# EAGLE schematic untitled (EAGLE 8.4.3)
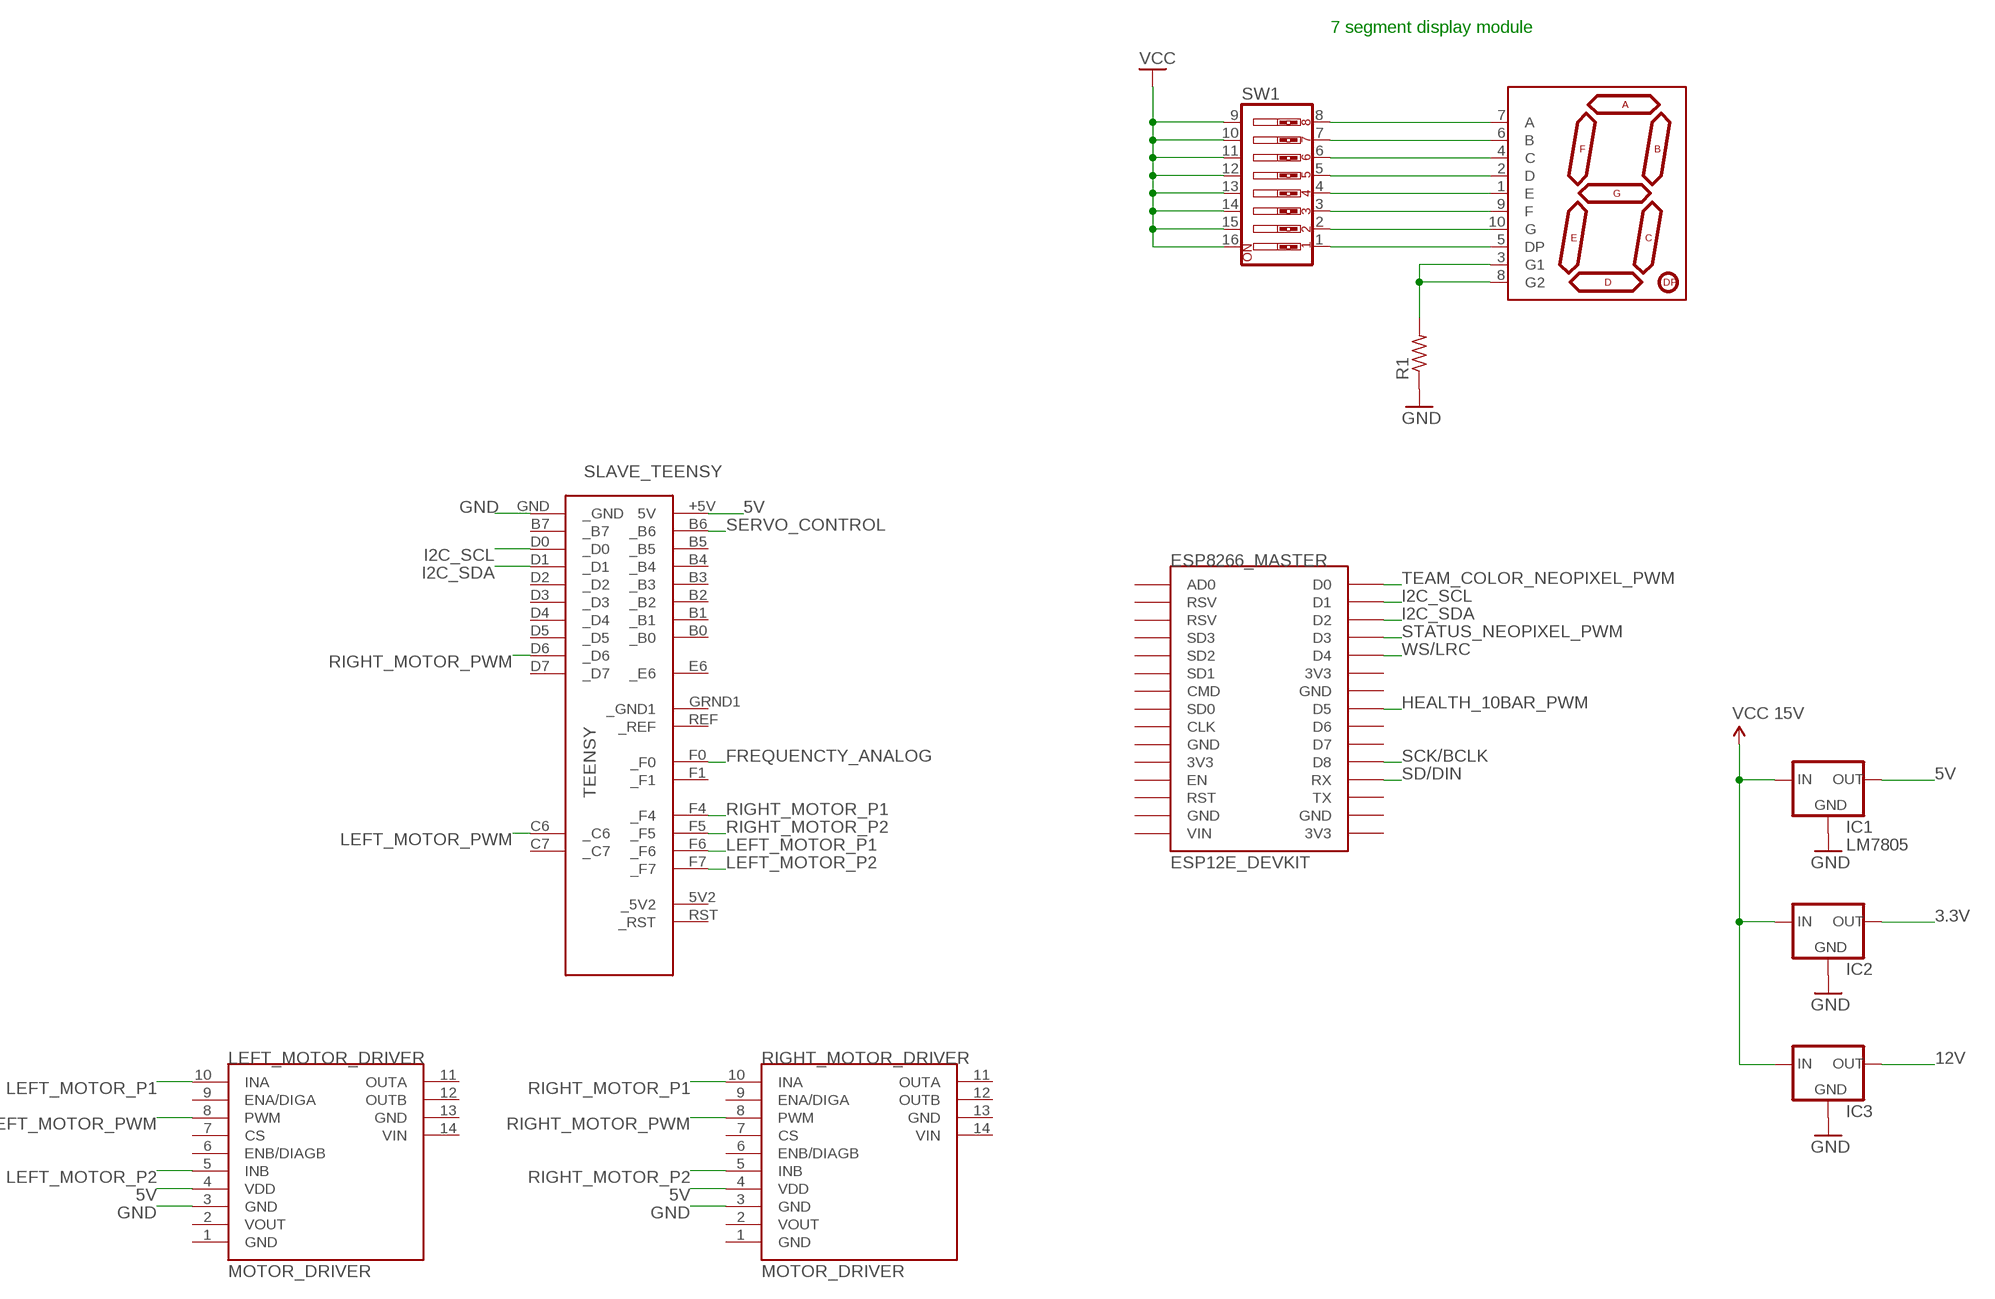
[diagram p0: schematic, sheet 1]

## Parts
ESP8266_MASTER  ESP12E_DEVKIT  [ESP12E_DEVKIT]
IC1  LM7805  V_REG_78XX-TO-220  [TO-220-ALT]
IC2  V_REG_78XX-TO-220  [TO-220-ALT]
IC3  V_REG_78XX-TO-220  [TO-220-ALT]
LEFT_MOTOR_DRIVER  MOTOR_DRIVER  [VNH5019A_MOTORDRIVER_CARIER_POLOLU]
R1  R-US_0204/2V  [0204V]
RIGHT_MOTOR_DRIVER  MOTOR_DRIVER  [VNH5019A_MOTORDRIVER_CARIER_POLOLU]
SLAVE_TEENSY  TEENSY  [TEENSY]
SW1  SW_DIP-8  [DIPSWITCH-08]
U$2  7-SEGMENT-DISPLAYPTH  [7-SEGMENT-DISPLAY]

## Nets
3.3V: IC2.OUT
5V: IC1.OUT LEFT_MOTOR_DRIVER.4(VDD) RIGHT_MOTOR_DRIVER.4(VDD) SLAVE_TEENSY.+5V(5V)
12V: IC3.OUT
FREQUENCTY_ANALOG: SLAVE_TEENSY.F0(_F0)
GND: IC1.GND IC2.GND IC3.GND LEFT_MOTOR_DRIVER.3(GND) R1.1 RIGHT_MOTOR_DRIVER.3(GND) SLAVE_TEENSY.GND(_GND)
HEALTH_10BAR_PWM: ESP8266_MASTER.D5
I2C_SCL: ESP8266_MASTER.D1 SLAVE_TEENSY.D0(_D0)
I2C_SDA: ESP8266_MASTER.D2 SLAVE_TEENSY.D1(_D1)
LEFT_MOTOR_P1: LEFT_MOTOR_DRIVER.10(INA) SLAVE_TEENSY.F6(_F6)
LEFT_MOTOR_P2: LEFT_MOTOR_DRIVER.5(INB) SLAVE_TEENSY.F7(_F7)
LEFT_MOTOR_PWM: LEFT_MOTOR_DRIVER.8(PWM) SLAVE_TEENSY.C6(_C6)
N$1: SW1.8 U$2.7(A)
N$2: SW1.7 U$2.6(B)
N$3: SW1.6 U$2.4(C)
N$4: SW1.5 U$2.2(D)
N$5: SW1.4 U$2.1(E)
N$6: SW1.3 U$2.9(F)
N$7: SW1.2 U$2.10(G)
N$8: SW1.1 U$2.5(DP)
N$9: R1.2 U$2.3(G1) U$2.8(G2)
RIGHT_MOTOR_P1: RIGHT_MOTOR_DRIVER.10(INA) SLAVE_TEENSY.F4(_F4)
RIGHT_MOTOR_P2: RIGHT_MOTOR_DRIVER.5(INB) SLAVE_TEENSY.F5(_F5)
RIGHT_MOTOR_PWM: RIGHT_MOTOR_DRIVER.8(PWM) SLAVE_TEENSY.D6(_D6)
SCK/BCLK: ESP8266_MASTER.D8
SD/DIN: ESP8266_MASTER.RX
SERVO_CONTROL: SLAVE_TEENSY.B6(_B6)
STATUS_NEOPIXEL_PWM: ESP8266_MASTER.D3
TEAM_COLOR_NEOPIXEL_PWM: ESP8266_MASTER.D0
VCC: IC1.IN IC2.IN IC3.IN SW1.9 SW1.10 SW1.11 SW1.12 SW1.13 SW1.14 SW1.15 SW1.16 ; supply symbol labelled VCC 15V
WS/LRC: ESP8266_MASTER.D4
Unconnected: ESP8266_MASTER.3V3@0(3V3) ESP8266_MASTER.3V3@1(3V3) ESP8266_MASTER.3V3@2(3V3) ESP8266_MASTER.AD0 ESP8266_MASTER.CLK ESP8266_MASTER.CMD ESP8266_MASTER.D6 ESP8266_MASTER.D7 ESP8266_MASTER.EN ESP8266_MASTER.GND@0(GND) ESP8266_MASTER.GND@1(GND) ESP8266_MASTER.GND@2(GND) ESP8266_MASTER.GND@3(GND) ESP8266_MASTER.RST ESP8266_MASTER.RSV@0(RSV) ESP8266_MASTER.RSV@1(RSV) ESP8266_MASTER.SD0 ESP8266_MASTER.SD1 ESP8266_MASTER.SD2 ESP8266_MASTER.SD3 ESP8266_MASTER.TX ESP8266_MASTER.VIN LEFT_MOTOR_DRIVER.1(GND) LEFT_MOTOR_DRIVER.2(VOUT) LEFT_MOTOR_DRIVER.6(ENB/DIAGB) LEFT_MOTOR_DRIVER.7(CS) LEFT_MOTOR_DRIVER.9(ENA/DIGA) LEFT_MOTOR_DRIVER.11(OUTA) LEFT_MOTOR_DRIVER.12(OUTB) LEFT_MOTOR_DRIVER.13(GND) LEFT_MOTOR_DRIVER.14(VIN) RIGHT_MOTOR_DRIVER.1(GND) RIGHT_MOTOR_DRIVER.2(VOUT) RIGHT_MOTOR_DRIVER.6(ENB/DIAGB) RIGHT_MOTOR_DRIVER.7(CS) RIGHT_MOTOR_DRIVER.9(ENA/DIGA) RIGHT_MOTOR_DRIVER.11(OUTA) RIGHT_MOTOR_DRIVER.12(OUTB) RIGHT_MOTOR_DRIVER.13(GND) RIGHT_MOTOR_DRIVER.14(VIN) SLAVE_TEENSY.5V2(_5V2) SLAVE_TEENSY.B0(_B0) SLAVE_TEENSY.B1(_B1) SLAVE_TEENSY.B2(_B2) SLAVE_TEENSY.B3(_B3) SLAVE_TEENSY.B4(_B4) SLAVE_TEENSY.B5(_B5) SLAVE_TEENSY.B7(_B7) SLAVE_TEENSY.C7(_C7) SLAVE_TEENSY.D2(_D2) SLAVE_TEENSY.D3(_D3) SLAVE_TEENSY.D4(_D4) SLAVE_TEENSY.D5(_D5) SLAVE_TEENSY.D7(_D7) SLAVE_TEENSY.E6(_E6) SLAVE_TEENSY.F1(_F1) SLAVE_TEENSY.GRND1(_GND1) SLAVE_TEENSY.REF(_REF) SLAVE_TEENSY.RST(_RST)

## Notes on the sheet
- 7 segment display module

## Library data of the parts
ESP8266_MASTER = ESP12E_DEVKIT:ESP12E_DEVKIT: ESP12E DEVKIT BOARD
IC1-IC3 = SparkFun-PowerIC:V_REG_78XX: Voltage Regulator Standard 7805 5V regulator. IGO (Input Ground Output). Spark Fun Electronics SKU : COM-00107
LEFT_MOTOR_DRIVER RIGHT_MOTOR_DRIVER = final_project_library:MOTOR_DRIVER
R1 = adafruit:R-US_: RESISTOR, American symbol
SLAVE_TEENSY = teensy:TEENSY: Teensy 2.0
SW1 = SparkFun:SW_DIP-8: DIP Switch 8 Position Spark Fun Electronics SKU : COM-08034
U$2 = SparkFun-Displays:7-SEGMENT-DISPLAY